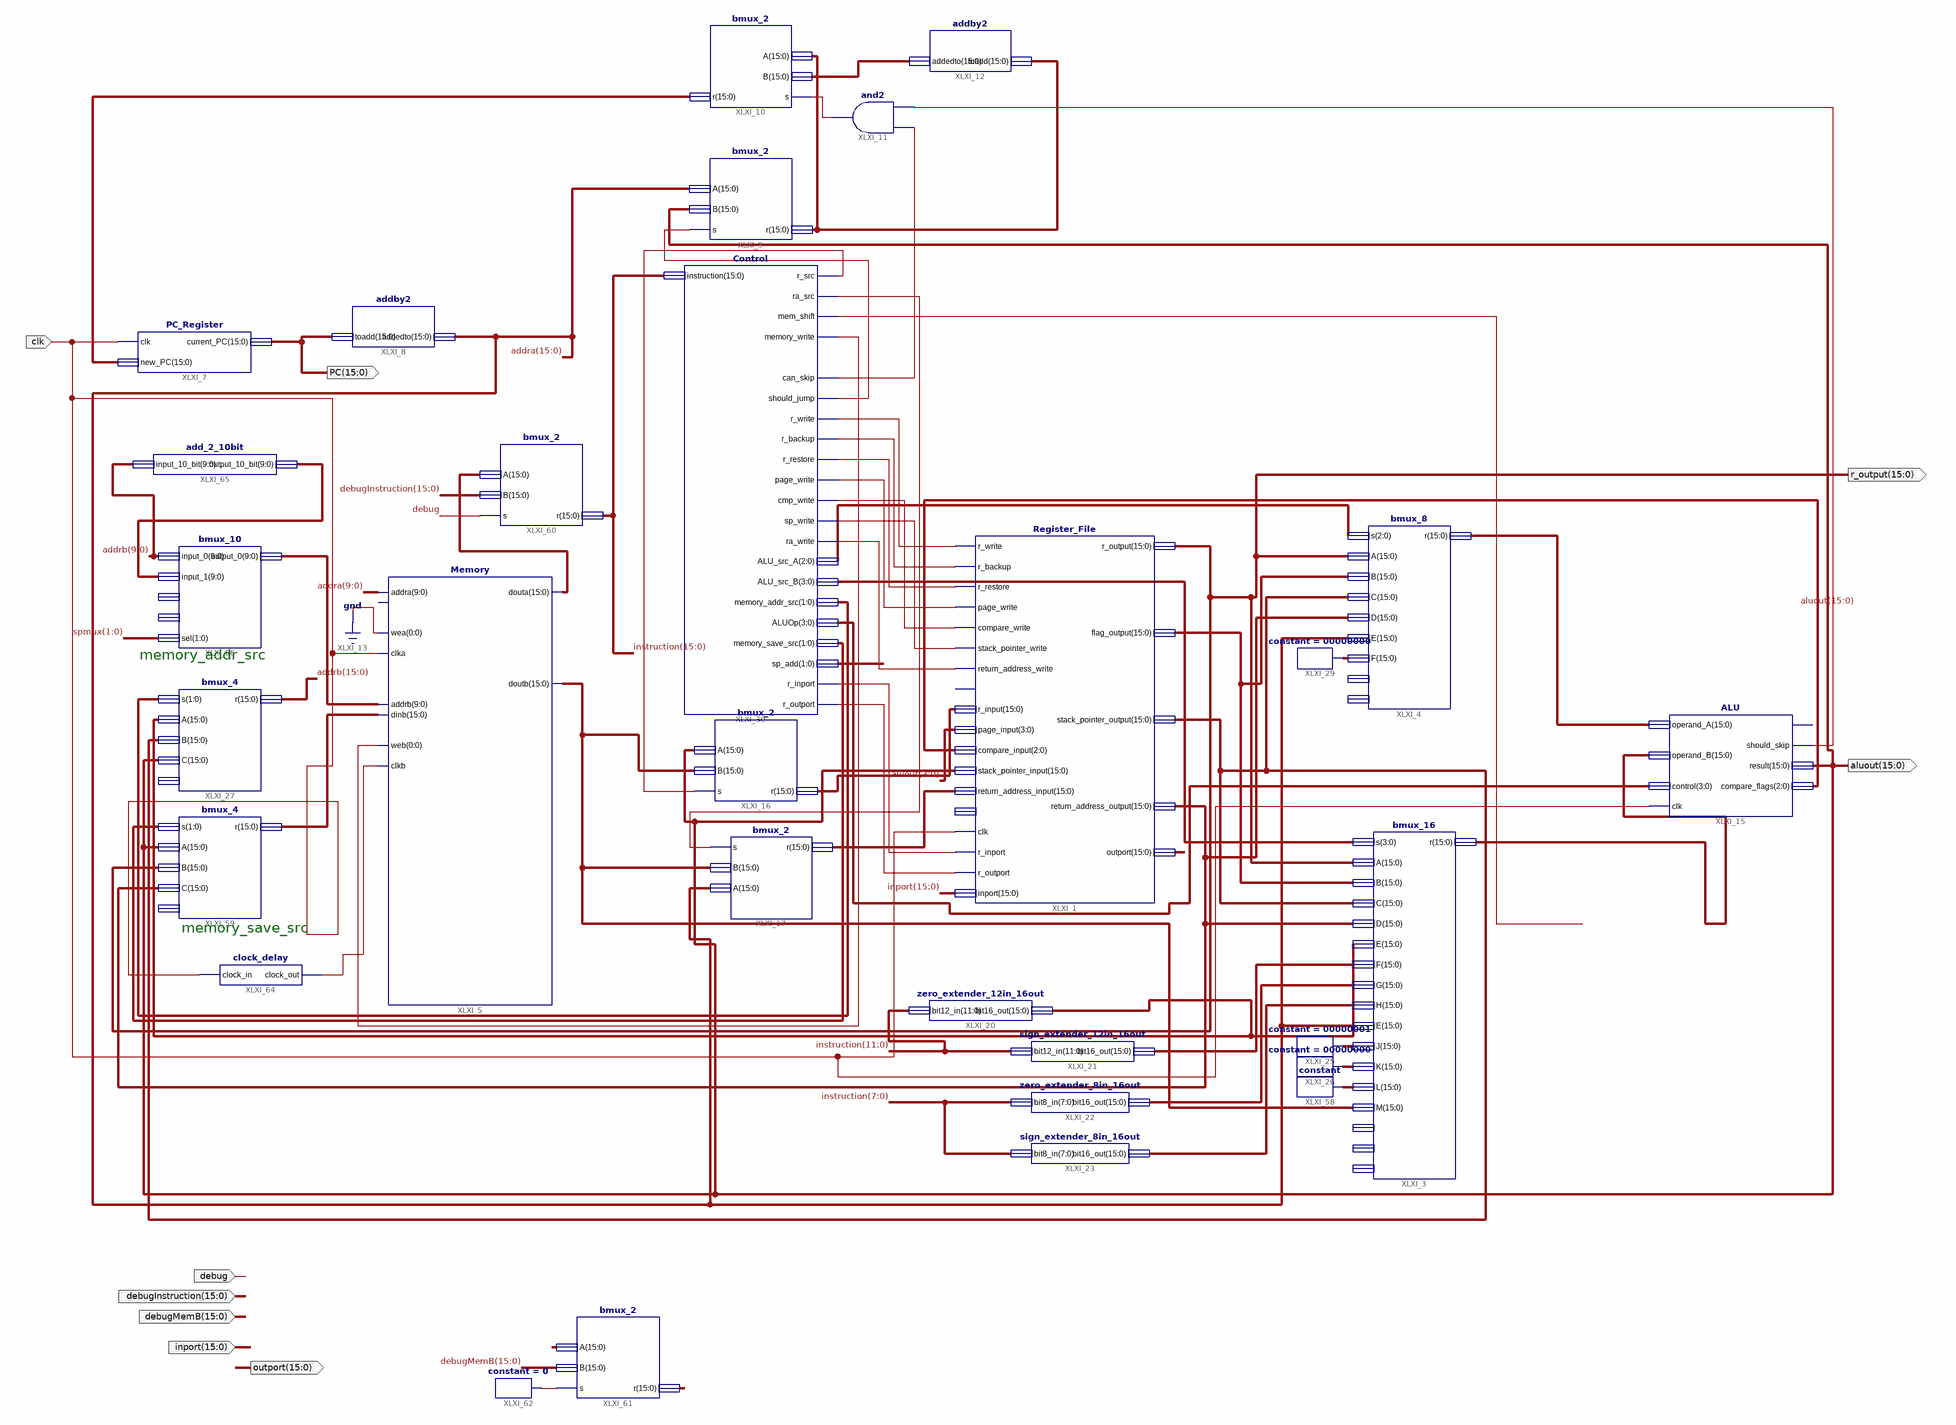
[diagram p0: schematic sheet 1]
// Xilinx ISE schematic BAMF_Datapath.sch (spartan3e) as structural Verilog: 30 symbols, 9 ports
module BAMF_Datapath (
  input  clk,
  input  debug,
  input  [15:0] debugInstruction,
  input  [15:0] debugMemB,
  input  [15:0] inport,
  output [15:0] PC,
  output [15:0] r_output,
  output [15:0] aluout,
  output [15:0] outport
);

  wire XLXN_16, XLXN_17, XLXN_18, XLXN_19, XLXN_20, XLXN_21, XLXN_22, XLXN_42, XLXN_43, XLXN_54, XLXN_70,
       XLXN_71, XLXN_113, XLXN_253, XLXN_256, XLXN_267, XLXN_288, XLXN_290;
  wire [0:0] XLXN_48;
  wire [1:0] spmux, XLXN_101, XLXN_201;
  wire [2:0] XLXN_55, XLXN_57;
  wire [3:0] XLXN_56, XLXN_58;
  wire [9:0] XLXN_274, XLXN_277;
  wire [15:0] addra, addrb, instruction, XLXN_44, XLXN_45, XLXN_51, XLXN_62, XLXN_68, XLXN_69, XLXN_79,
       XLXN_86, XLXN_88, XLXN_89, XLXN_96, XLXN_97, XLXN_98, XLXN_102, XLXN_104, XLXN_105, XLXN_112,
       XLXN_200, XLXN_202, XLXN_208, XLXN_258, XLXN_259, XLXN_260;

  Register_File XLXI_1 (
    .r_write(XLXN_16), .r_backup(XLXN_17), .r_restore(XLXN_18), .page_write(XLXN_19),
    .compare_write(XLXN_20), .stack_pointer_write(XLXN_21), .return_address_write(XLXN_22), .clk(clk),
    .r_input(XLXN_68), .page_input(aluout[3:0]), .compare_input(XLXN_55), .stack_pointer_input(aluout),
    .return_address_input(XLXN_69), .r_output(r_output), .flag_output(XLXN_62),
    .stack_pointer_output(XLXN_105), .return_address_output(XLXN_202), .r_inport(XLXN_288),
    .r_outport(XLXN_290), .inport(inport), .outport(outport));  // open: interrupt_write, interrupt_input
  bmux_16 XLXI_3 (
    .s(XLXN_58), .A(r_output), .B(XLXN_62), .C(XLXN_105), .D(XLXN_202), .E(XLXN_104), .F(XLXN_86),
    .G(XLXN_88), .H(XLXN_89), .I(addra), .J(XLXN_97), .K(XLXN_98), .L(XLXN_200), .M(XLXN_260), .r(XLXN_79));  // open: N, O, P
  bmux_8 XLXI_4 (
    .s(XLXN_57), .A(r_output), .B(XLXN_62), .C(XLXN_105), .D(XLXN_202), .E(addra), .F(XLXN_112), .r(XLXN_51));  // open: G, H
  Memory XLXI_5 (
    .addra(addra[9:0]), .wea(1'b0), .clka(clk), .addrb(XLXN_277), .dinb(XLXN_102), .web(XLXN_48[0]),
    .clkb(XLXN_267), .douta(XLXN_208), .doutb(XLXN_260));  // open: dina
  PC_Register XLXI_7 (.clk(clk), .new_PC(XLXN_96), .current_PC(PC));
  addby2 XLXI_8 (.toadd(PC), .addedto(addra));
  bmux_2 XLXI_9 (.A(addra), .B(aluout), .s(XLXN_113), .r(XLXN_44));
  bmux_2 XLXI_10 (.A(XLXN_44), .B(XLXN_45), .s(XLXN_43), .r(XLXN_96));
  addby2 XLXI_12 (.toadd(XLXN_44), .addedto(XLXN_45));
  ALU XLXI_15 (
    .operand_A(XLXN_51), .operand_B(XLXN_79), .control(XLXN_56), .should_skip(XLXN_54), .result(aluout),
    .compare_flags(XLXN_55), .clk(clk));  // open: zero_indicator
  bmux_2 XLXI_16 (.A(aluout), .B(XLXN_260), .s(XLXN_70), .r(XLXN_68));
  bmux_2 XLXI_17 (.A(addra), .B(XLXN_260), .s(XLXN_71), .r(XLXN_69));
  zero_extender_12in_16out XLXI_20 (.bit12_in(instruction[11:0]), .bit16_out(XLXN_104));
  sign_extender_12in_16out XLXI_21 (.bit12_in(instruction[11:0]), .bit16_out(XLXN_86));
  zero_extender_8in_16out XLXI_22 (.bit8_in(instruction[7:0]), .bit16_out(XLXN_88));
  sign_extender_8in_16out XLXI_23 (.bit8_in(instruction[7:0]), .bit16_out(XLXN_89));
  constant #(.CValue("00000001")) XLXI_25 (.O(XLXN_97));
  constant #(.CValue("00000000")) XLXI_26 (.O(XLXN_98));
  bmux_4 XLXI_27 (.s(XLXN_101), .A(XLXN_104), .B(XLXN_105), .C(aluout), .r(addrb));  // open: D
  and XLXI_11 (XLXN_43, XLXN_42, XLXN_54);
  constant #(.CValue("00000000")) XLXI_29 (.O(XLXN_112));
  Control XLXI_30 (
    .instruction(instruction), .r_src(XLXN_70), .ra_src(XLXN_71), .mem_shift(XLXN_253),
    .memory_write(XLXN_48[0]), .can_skip(XLXN_42), .should_jump(XLXN_113), .r_write(XLXN_16),
    .r_backup(XLXN_17), .r_restore(XLXN_18), .page_write(XLXN_19), .cmp_write(XLXN_20), .sp_write(XLXN_21),
    .ra_write(XLXN_22), .ALU_src_A(XLXN_57), .ALU_src_B(XLXN_58), .memory_save_src(XLXN_201),
    .memory_addr_src(XLXN_101), .ALUOp(XLXN_56), .sp_add(spmux), .r_inport(XLXN_288), .r_outport(XLXN_290));
  constant XLXI_58 (.O(XLXN_200));
  bmux_4 XLXI_59 (.s(XLXN_201), .A(aluout), .B(r_output), .C(XLXN_202), .r(XLXN_102));  // open: D
  bmux_2 XLXI_60 (.A(XLXN_208), .B(debugInstruction), .s(debug), .r(instruction));
  bmux_2 XLXI_61 (.A(XLXN_259), .B(debugMemB), .s(XLXN_256), .r(XLXN_258));
  constant #(.CValue("0")) XLXI_62 (.O(XLXN_256));
  clock_delay XLXI_64 (.clock_in(clk), .clock_out(XLXN_267));
  add_2_10bit XLXI_65 (.input_10_bit(addrb[9:0]), .output_10_bit(XLXN_274));
  bmux_10 XLXI_66 (
    .input_0(addrb[9:0]), .input_1(XLXN_274), .sel(spmux), .output_0(XLXN_277));  // open: input_2, input_3

  // Notes on the sheet:
  //   memory_addr_src
  //   memory_save_src
endmodule
